# Altium schematic sheet PDM-S03-V00-PSU.SchDoc: Power Supply (V-V to 3V3 @ 0.?-0.?A)
size A3; DrawnBy: Jonn Dillon; Organization: QUT Motorsport; Address1: O-120, Gardens Point; Address2: 2 George Street; Address3: Brisbane, QLD 4000; Address4: Australia; DocumentNumber: 3; Revision: 01; SheetNumber: 3; SheetTotal: 9; Version: 01; Project: Power Distribution Module; PageSetup: Record=PageOptions|CenterHorizontal=True|CenterVertical=True|PrintScale=0.97|XCorrection=1.00|YCorrection=1.00|PrintKind=0|BorderSize=5000000|LeftOffset=0|BottomOffset=0|Orientation=2|PaperLength=1000|PaperWidth=1000|Scale=100|PaperSource=7|PrintQuality=-4|MediaType=1|DitherType=10|PaperKind=A4|PrintScaleMode=1
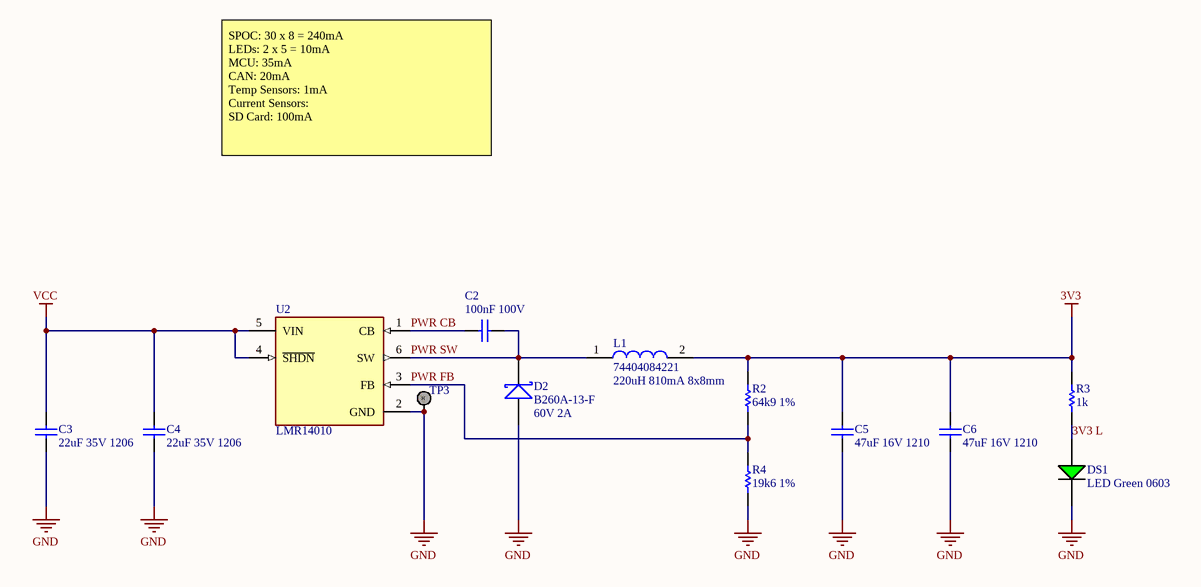
[diagram p0: PDM-S03-V00-PSU.SchDoc]

## Parts
C2  100nF 100V  [Cap_Ceramic_0603]
C3  22uF 35V 1206  [Cap_Ceramic_1206]
C4  22uF 35V 1206  [Cap_Ceramic_1206]
C5  47uF 16V 1210  [Cap_Ceramic_1210]
C6  47uF 16V 1210  [Cap_Ceramic_1210]
D2  B260A-13-F  [SMA]
DS1  LED Green 0603  [LED GREEN 0603]
L1  74404084221  [Inductor_8x8mm]
R2  64k9 1%  [Res_ThinFilm_0603]
R3  1k  [Res_ThinFilm_0603]
R4  19k6 1%  [Res_ThinFilm_0603]
TP3  TestPoint_Hoop_Black  [TestPointHoop_BLACK]  (value not drawn)
U2  LMR14010  [LMR14010]

## Nets
3V3: C5.2 C6.2 L1.2 R2.2 R3.2
GND: C3.1 C4.1 C5.1 C6.1 D2.A DS1.2(C) R4.1 TP3.1 U2.2(GND)
VCC: C3.2 C4.2 U2.4(~{SHDN}) U2.5(VIN)
3V3 L: DS1.1(A) R3.1
PWR CB: C2.1 U2.1(CB)
PWR FB: R2.1 R4.2 U2.3(FB)
PWR SW: C2.2 D2.K L1.1 U2.6(SW)

## Notes on the sheet
- SPOC: 30 x 8 = 240mA
  LEDs: 2 x 5 = 10mA
  MCU: 35mA
  CAN: 20mA
  Temp Sensors: 1mA
  Current Sensors:
  SD Card: 100mA
- (near L1) 220uH 810mA 8x8mm
- (near D2) 60V 2A
- Revision History:
- Sheet Title:
- Rev
- Date
- Description
- Project:
- Size:
- Drawn By:
- A3
- Number:
- Revision:
- Sheet
- Version:
- of
- QUT Motorsport
- O-120, Gardens Point
- 2 George Street
- Brisbane, QLD 4000
- Australia
- Print Date:
- Print Time:
- File Name:
- (in symbol TestPoint_Hoop_Black) H

## Library data of the parts
C2 = 100nF 100V 5% X7R 0603: Capacitor, Ceramic, SMD, 100nF, 100V, 5%, X7R, 0603
C3 C4 = 22uF 35V 10% X7R 1206: Capacitor, Ceramic, SMD, 22uF, 35V, 10%, X7R, 1206
C5 C6 = 47uF 16V 10% X7R 1210: Capacitor, Ceramic, SMD, 47uF, 16V, 5%, X7R, 1210
D2 = B260A-13-F: Diode, Schottky Barrier Rectifier, 60 V, 2 A, B260A-13-F
L1 = 74404084221: FIXED IND 220UH 810MA 592 MOHM; ComponentLink1Description: Datasheet; ComponentLink1URL: https://www.we-online.de/katalog/datasheet/74404084221.pdf; ComponentLink2Description: Digikey; ComponentLink2URL: https://www.digikey.com.au/product-detail/en/w%C3%BCrth-elektronik/74404084221/732-7266-1-ND/5353246?fbclid=IwAR2IQj7zcmEUnJ8n40LKmguzerTSd0zliF9ouewbw6PbKBP8Cf58NndJ4Os
R2 = 64k9 1% 0603: Resistor, SMD, 64k9, 0.1W, 5%, 0603
R3 = 1k 5% 0603: Resistor, SMD, 1k, 0.1W, 5%, 0603
R4 = 19k6 1% 0603: Resistor, SMD, 19k6, 0.1W, 5%, 0603